# Altium schematic sheet efn32gg990.SchDoc
size C
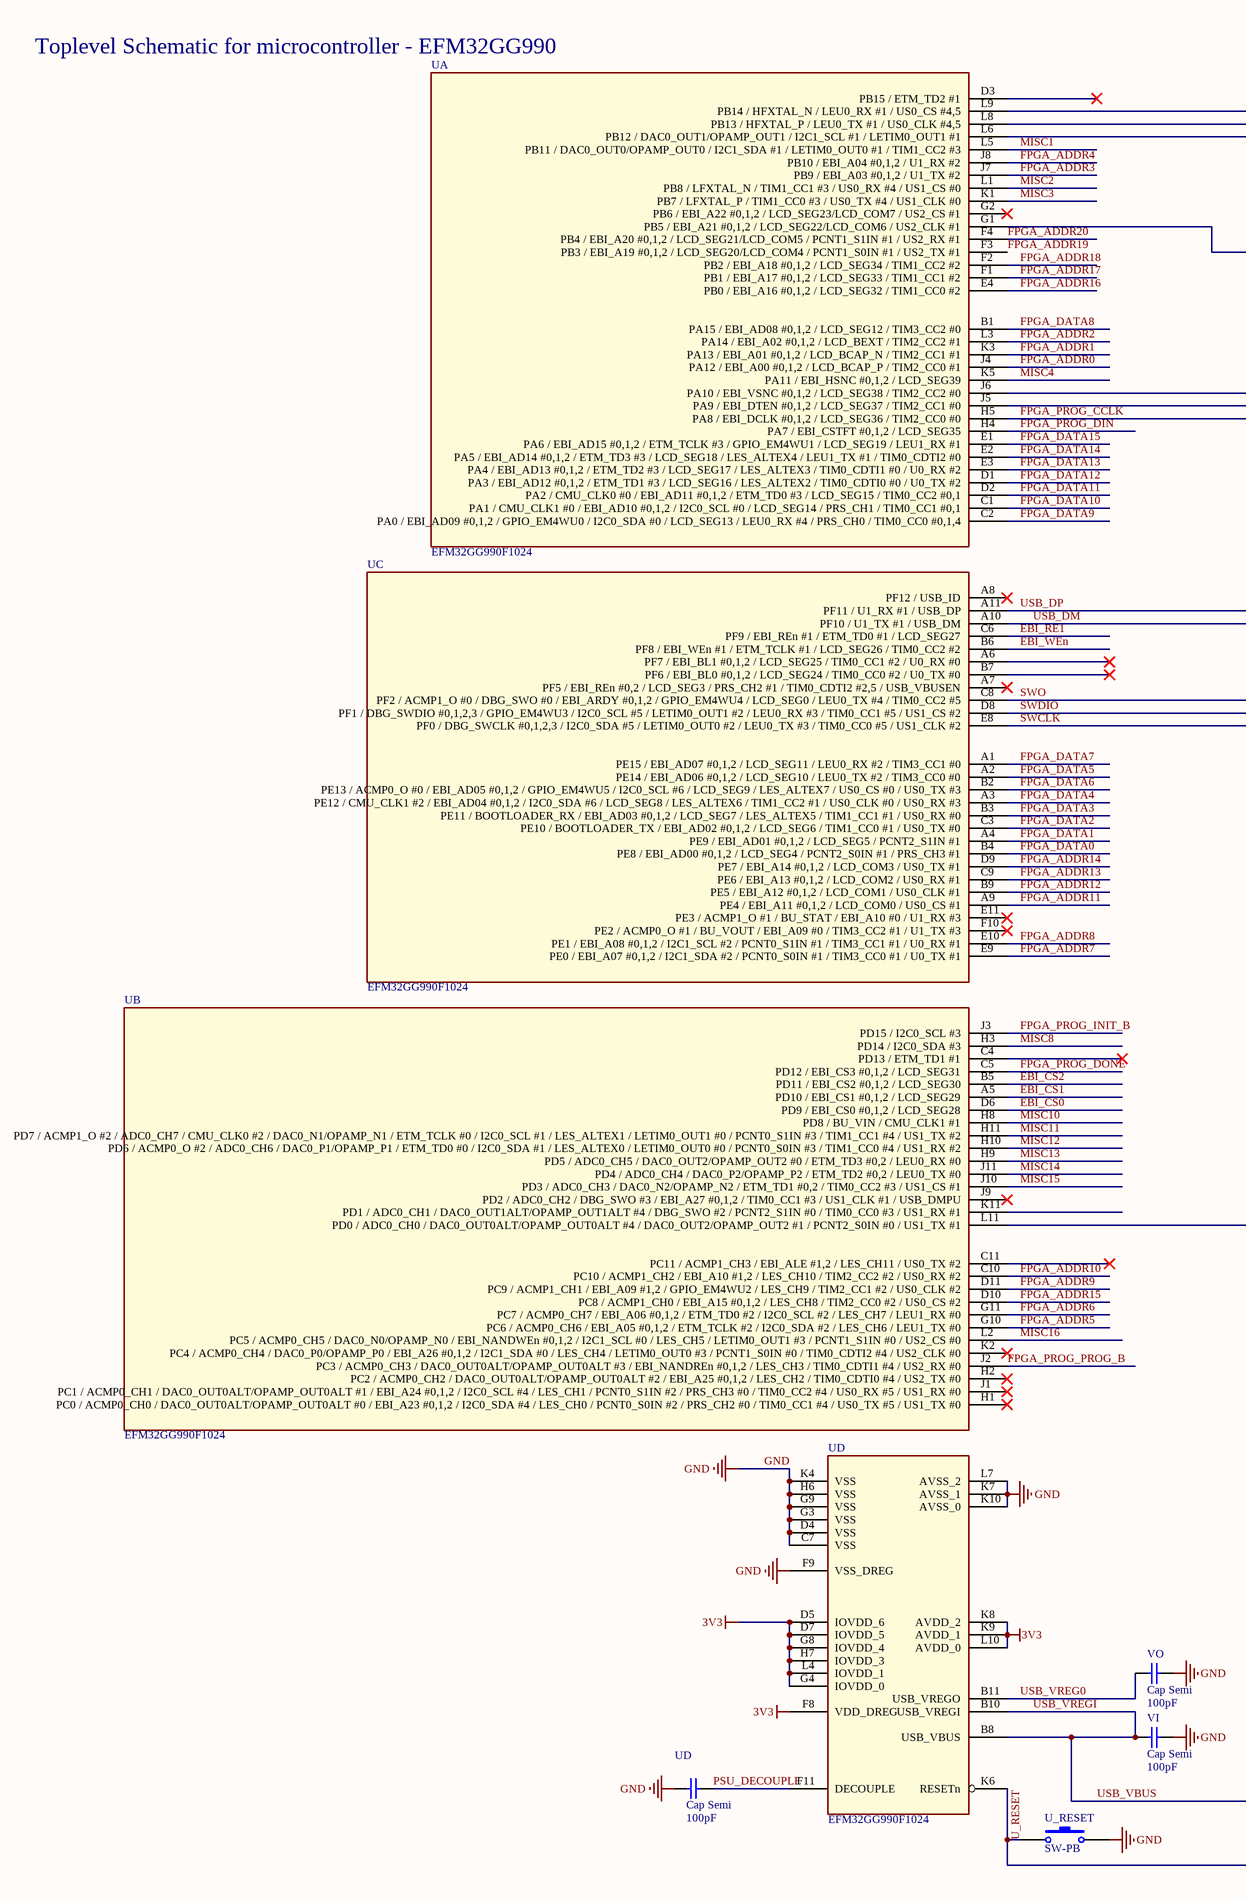
[diagram p0: efn32gg990.SchDoc, left]
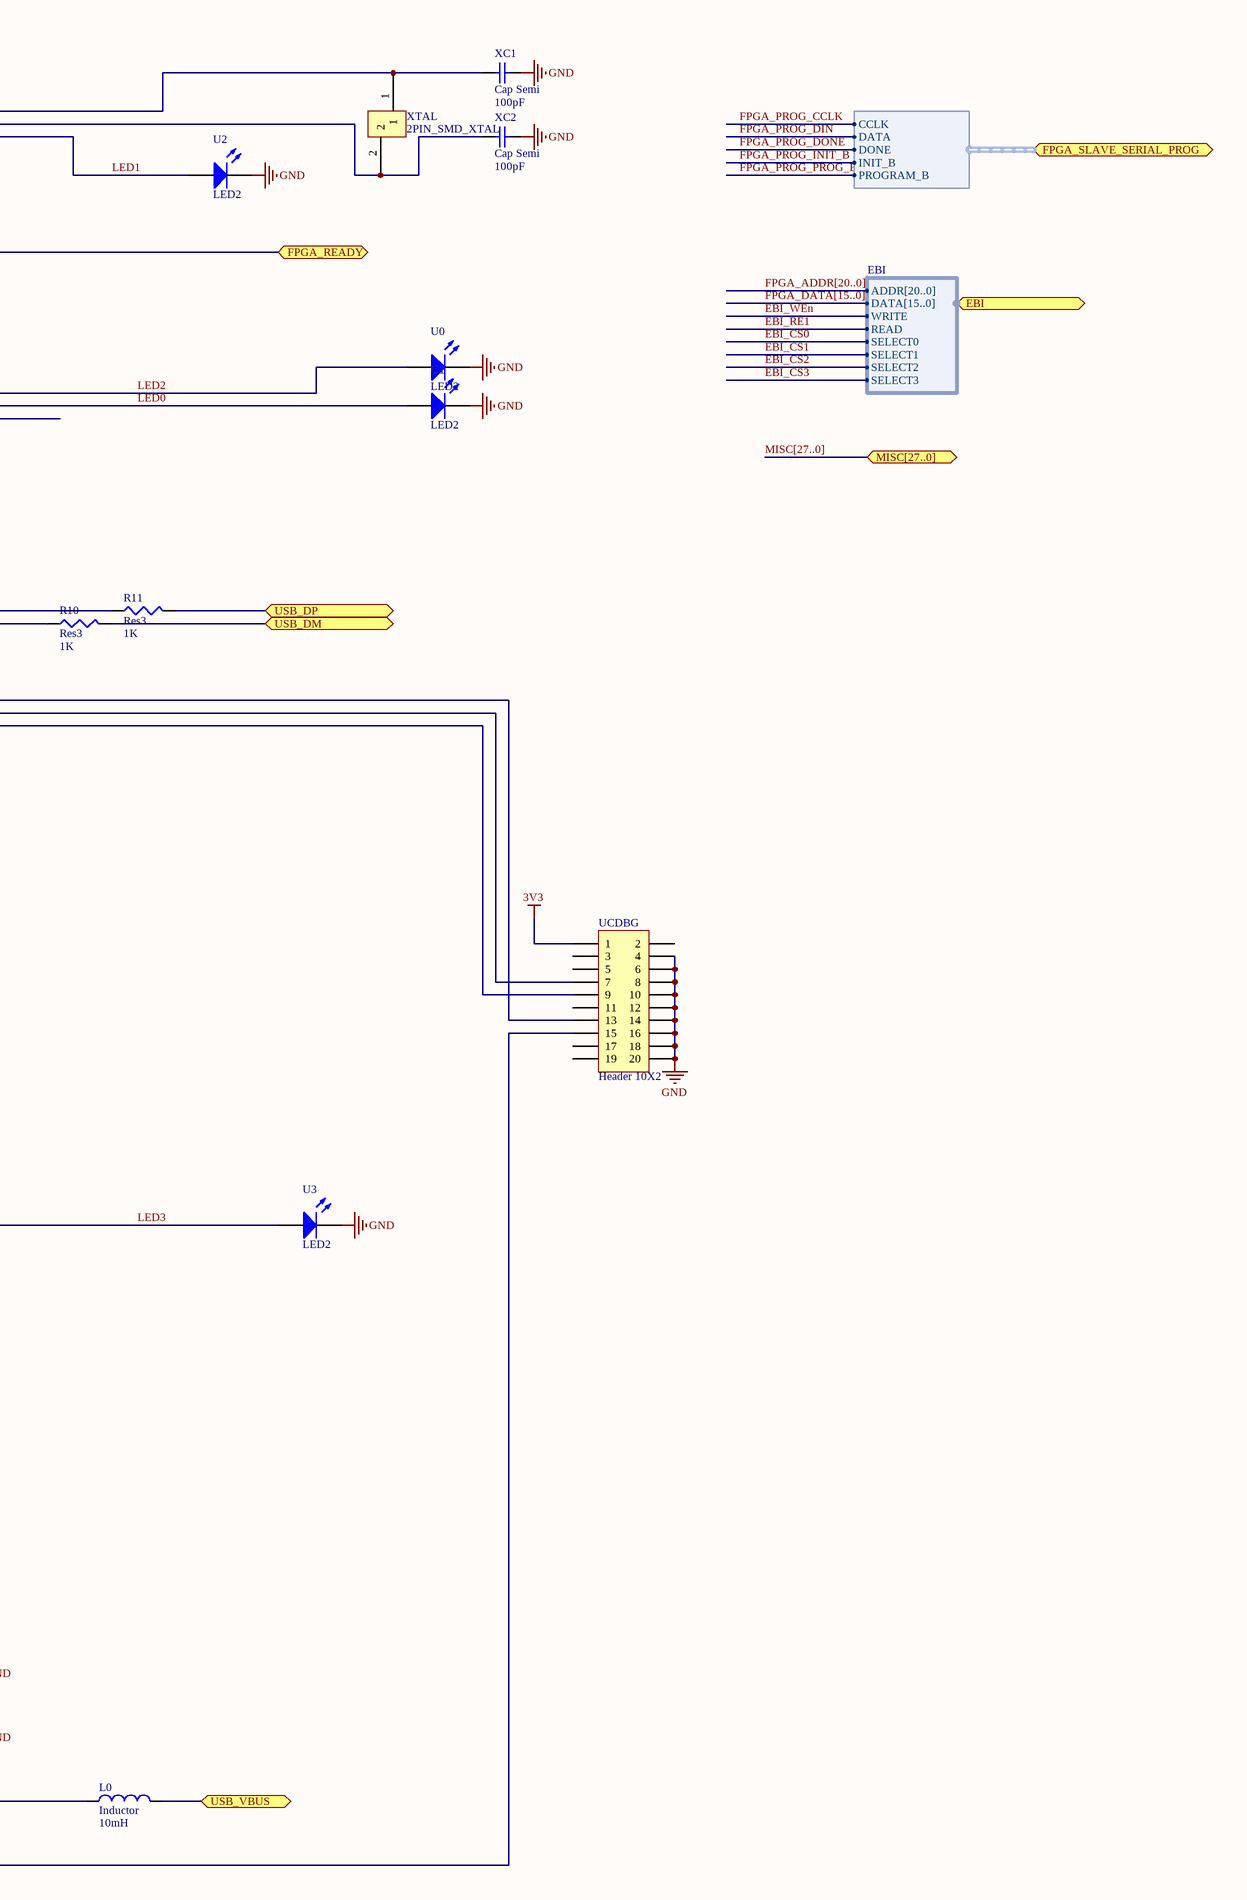
[diagram p1: efn32gg990.SchDoc, right]

## Parts
L0  Inductor  value 10mH  [C1210]
R10  Res3  value 1K  [14-1210]
R11  Res3  value 1K  [14-1210]
U  EFM32GG990F1024  [BGA112]  (parts A,B,C,D of 4)
U0  LED2  [3.2X1.6X1.1]
U1  LED2  [3.2X1.6X1.1]
U2  LED2  [3.2X1.6X1.1]
U3  LED2  [3.2X1.6X1.1]
U_RESET  SW-PB  [SPST-2]
UCDBG  Header 10X2  [HDR2X10]
UD  Cap Semi  value 100pF  [C1206]
VI  Cap Semi  value 100pF  [C1206]
VO  Cap Semi  value 100pF  [C1206]
XC1  Cap Semi  value 100pF  [C1206]
XC2  Cap Semi  value 100pF  [C1206]
XTAL  2PIN_SMD_XTAL  [48MHZ_XTAL_PAD]

## Ports
EBI (harness EBI), FPGA_READY, FPGA_SLAVE_SERIAL_PROG (harness FPGA_SLAVE_SERIAL_PROG), MISC[27..0], USB_DM, USB_DP, USB_VBUS

## Harnesses
FPGA_SLAVE_SERIAL_PROG: CCLK, DATA, DONE, INIT_B, PROGRAM_B
EBI: READ, WRITE, SELECT0, DATA[15..0], ADDR[20..0], SELECT1, SELECT2, SELECT3

## Nets
3V3: U.D5(IOVDD_6) U.D7(IOVDD_5) U.F8(VDD_DREG) U.G4(IOVDD_0) U.G8(IOVDD_4) U.H7(IOVDD_3) U.K8(AVDD_2) U.K9(AVDD_1) U.L4(IOVDD_1) U.L10(AVDD_0) UCDBG.1
GND: U.C7(VSS) U.D4(VSS) U.F9(VSS_DREG) U.G3(VSS) U.G9(VSS) U.H6(VSS) U.K4(VSS) U.K7(AVSS_1) U.K10(AVSS_0) U.L7(AVSS_2) U0.2(K) U1.2(K) U2.2(K) U3.2(K) U_RESET.2 UCDBG.4 UCDBG.6 UCDBG.8 UCDBG.10 UCDBG.12 UCDBG.14 UCDBG.16 UCDBG.18 UCDBG.20 UD.1 VI.2 VO.2 XC1.2 XC2.2
EBI_CS0: U.D6(PD9_/_EBI_CS0_#0,1,2_/_LCD_SEG28) ; port EBI.SELECT0
EBI_CS1: U.A5(PD10_/_EBI_CS1_#0,1,2_/_LCD_SEG29) ; port EBI.SELECT1
EBI_CS2: U.B5(PD11_/_EBI_CS2_#0,1,2_/_LCD_SEG30) ; port EBI.SELECT2
EBI_CS3: port EBI.SELECT3
EBI_RE1: U.C6(PF9_/_EBI_REn_#1_/_ETM_TD0_#1_/_LCD_SEG27) ; port EBI.READ
EBI_WEn: U.B6(PF8_/_EBI_WEn_#1_/_ETM_TCLK_#1_/_LCD_SEG26_/_TIM0_CC2_#2) ; port EBI.WRITE
FPGA_ADDR0: U.J4(PA12_/_EBI_A00_#0,1,2_/_LCD_BCAP_P_/_TIM2_CC0_#1)
FPGA_ADDR1: U.K3(PA13_/_EBI_A01_#0,1,2_/_LCD_BCAP_N_/_TIM2_CC1_#1)
FPGA_ADDR2: U.L3(PA14_/_EBI_A02_#0,1,2_/_LCD_BEXT_/_TIM2_CC2_#1)
FPGA_ADDR3: U.J7(PB9_/_EBI_A03_#0,1,2_/_U1_TX_#2)
FPGA_ADDR4: U.J8(PB10_/_EBI_A04_#0,1,2_/_U1_RX_#2)
FPGA_ADDR5: U.G10(PC6_/_ACMP0_CH6_/_EBI_A05_#0,1,2_/_ETM_TCLK_#2_/_I2C0_SDA_#2_/_LES_CH6_/_LEU1_TX_#0)
FPGA_ADDR6: U.G11(PC7_/_ACMP0_CH7_/_EBI_A06_#0,1,2_/_ETM_TD0_#2_/_I2C0_SCL_#2_/_LES_CH7_/_LEU1_RX_#0)
FPGA_ADDR7: U.E9(PE0_/_EBI_A07_#0,1,2_/_I2C1_SDA_#2_/_PCNT0_S0IN_#1_/_TIM3_CC0_#1_/_U0_TX_#1)
FPGA_ADDR8: U.E10(PE1_/_EBI_A08_#0,1,2_/_I2C1_SCL_#2_/_PCNT0_S1IN_#1_/_TIM3_CC1_#1_/_U0_RX_#1)
FPGA_ADDR9: U.D11(PC9_/_ACMP1_CH1_/_EBI_A09_#1,2_/_GPIO_EM4WU2_/_LES_CH9_/_TIM2_CC1_#2_/_US0_CLK_#2)
FPGA_ADDR10: U.C10(PC10_/_ACMP1_CH2_/_EBI_A10_#1,2_/_LES_CH10_/_TIM2_CC2_#2_/_US0_RX_#2)
FPGA_ADDR11: U.A9(PE4_/_EBI_A11_#0,1,2_/_LCD_COM0_/_US0_CS_#1)
FPGA_ADDR12: U.B9(PE5_/_EBI_A12_#0,1,2_/_LCD_COM1_/_US0_CLK_#1)
FPGA_ADDR13: U.C9(PE6_/_EBI_A13_#0,1,2_/_LCD_COM2_/_US0_RX_#1)
FPGA_ADDR14: U.D9(PE7_/_EBI_A14_#0,1,2_/_LCD_COM3_/_US0_TX_#1)
FPGA_ADDR15: U.D10(PC8_/_ACMP1_CH0_/_EBI_A15_#0,1,2_/_LES_CH8_/_TIM2_CC0_#2_/_US0_CS_#2)
FPGA_ADDR16: U.E4(PB0_/_EBI_A16_#0,1,2_/_LCD_SEG32_/_TIM1_CC0_#2)
FPGA_ADDR17: U.F1(PB1_/_EBI_A17_#0,1,2_/_LCD_SEG33_/_TIM1_CC1_#2)
FPGA_ADDR18: U.F2(PB2_/_EBI_A18_#0,1,2_/_LCD_SEG34_/_TIM1_CC2_#2)
FPGA_ADDR19: U.F3(PB3_/_EBI_A19_#0,1,2_/_LCD_SEG20/LCD_COM4_/_PCNT1_S0IN_#1_/_US2_TX_#1)
FPGA_ADDR20: U.F4(PB4_/_EBI_A20_#0,1,2_/_LCD_SEG21/LCD_COM5_/_PCNT1_S1IN_#1_/_US2_RX_#1)
FPGA_DATA0: U.B4(PE8_/_EBI_AD00_#0,1,2_/_LCD_SEG4_/_PCNT2_S0IN_#1_/_PRS_CH3_#1)
FPGA_DATA1: U.A4(PE9_/_EBI_AD01_#0,1,2_/_LCD_SEG5_/_PCNT2_S1IN_#1)
FPGA_DATA2: U.C3(PE10_/_BOOTLOADER_TX_/_EBI_AD02_#0,1,2_/_LCD_SEG6_/_TIM1_CC0_#1_/_US0_TX_#0)
FPGA_DATA3: U.B3(PE11_/_BOOTLOADER_RX_/_EBI_AD03_#0,1,2_/_LCD_SEG7_/_LES_ALTEX5_/_TIM1_CC1_#1_/_US0_RX_#0)
FPGA_DATA4: U.A3(PE12_/_CMU_CLK1_#2_/_EBI_AD04_#0,1,2_/_I2C0_SDA_#6_/_LCD_SEG8_/_LES_ALTEX6_/_TIM1_CC2_#1_/_US0_CLK_#0_/_US0_RX_#3)
FPGA_DATA5: U.A2(PE14_/_EBI_AD06_#0,1,2_/_LCD_SEG10_/_LEU0_TX_#2_/_TIM3_CC0_#0)
FPGA_DATA6: U.B2(PE13_/_ACMP0_O_#0_/_EBI_AD05_#0,1,2_/_GPIO_EM4WU5_/_I2C0_SCL_#6_/_LCD_SEG9_/_LES_ALTEX7_/_US0_CS_#0_/_US0_TX_#3)
FPGA_DATA7: U.A1(PE15_/_EBI_AD07_#0,1,2_/_LCD_SEG11_/_LEU0_RX_#2_/_TIM3_CC1_#0)
FPGA_DATA8: U.B1(PA15_/_EBI_AD08_#0,1,2_/_LCD_SEG12_/_TIM3_CC2_#0)
FPGA_DATA9: U.C2(PA0_/_EBI_AD09_#0,1,2_/_GPIO_EM4WU0_/_I2C0_SDA_#0_/_LCD_SEG13_/_LEU0_RX_#4_/_PRS_CH0_/_TIM0_CC0_#0,1,4)
FPGA_DATA10: U.C1(PA1_/_CMU_CLK1_#0_/_EBI_AD10_#0,1,2_/_I2C0_SCL_#0_/_LCD_SEG14_/_PRS_CH1_/_TIM0_CC1_#0,1)
FPGA_DATA11: U.D2(PA2_/_CMU_CLK0_#0_/_EBI_AD11_#0,1,2_/_ETM_TD0_#3_/_LCD_SEG15_/_TIM0_CC2_#0,1)
FPGA_DATA12: U.D1(PA3_/_EBI_AD12_#0,1,2_/_ETM_TD1_#3_/_LCD_SEG16_/_LES_ALTEX2_/_TIM0_CDTI0_#0_/_U0_TX_#2)
FPGA_DATA13: U.E3(PA4_/_EBI_AD13_#0,1,2_/_ETM_TD2_#3_/_LCD_SEG17_/_LES_ALTEX3_/_TIM0_CDTI1_#0_/_U0_RX_#2)
FPGA_DATA14: U.E2(PA5_/_EBI_AD14_#0,1,2_/_ETM_TD3_#3_/_LCD_SEG18_/_LES_ALTEX4_/_LEU1_TX_#1_/_TIM0_CDTI2_#0)
FPGA_DATA15: U.E1(PA6_/_EBI_AD15_#0,1,2_/_ETM_TCLK_#3_/_GPIO_EM4WU1_/_LCD_SEG19_/_LEU1_RX_#1)
FPGA_PROG_CCLK: U.H5(PA8_/_EBI_DCLK_#0,1,2_/_LCD_SEG36_/_TIM2_CC0_#0) ; port FPGA_SLAVE_SERIAL_PROG.CCLK
FPGA_PROG_DIN: U.H4(PA7_/_EBI_CSTFT_#0,1,2_/_LCD_SEG35) ; port FPGA_SLAVE_SERIAL_PROG.DATA
FPGA_PROG_DONE: U.C5(PD12_/_EBI_CS3_#0,1,2_/_LCD_SEG31) ; port FPGA_SLAVE_SERIAL_PROG.DONE
FPGA_PROG_INIT_B: U.J3(PD15_/_I2C0_SCL_#3) ; port FPGA_SLAVE_SERIAL_PROG.INIT_B
FPGA_PROG_PROG_B: U.J2(PC3_/_ACMP0_CH3_/_DAC0_OUT0ALT/OPAMP_OUT0ALT_#3_/_EBI_NANDREn_#0,1,2_/_LES_CH3_/_TIM0_CDTI1_#4_/_US2_RX_#0) ; port FPGA_SLAVE_SERIAL_PROG.PROGRAM_B
FPGA_READY: U.G1(PB5_/_EBI_A21_#0,1,2_/_LCD_SEG22/LCD_COM6_/_US2_CLK_#1) ; port FPGA_READY
LED0: U.J5(PA9_/_EBI_DTEN_#0,1,2_/_LCD_SEG37_/_TIM2_CC1_#0) U1.1(A)
LED1: U.L6(PB12_/_DAC0_OUT1/OPAMP_OUT1_/_I2C1_SCL_#1_/_LETIM0_OUT1_#1) U2.1(A)
LED2: U.J6(PA10_/_EBI_VSNC_#0,1,2_/_LCD_SEG38_/_TIM2_CC2_#0) U0.1(A)
LED3: U.L11(PD0_/_ADC0_CH0_/_DAC0_OUT0ALT/OPAMP_OUT0ALT_#4_/_DAC0_OUT2/OPAMP_OUT2_#1_/_PCNT2_S0IN_#0_/_US1_TX_#1) U3.1(A)
MISC1: U.L5(PB11_/_DAC0_OUT0/OPAMP_OUT0_/_I2C1_SDA_#1_/_LETIM0_OUT0_#1_/_TIM1_CC2_#3)
MISC2: U.L1(PB8_/_LFXTAL_N_/_TIM1_CC1_#3_/_US0_RX_#4_/_US1_CS_#0)
MISC3: U.K1(PB7_/_LFXTAL_P_/_TIM1_CC0_#3_/_US0_TX_#4_/_US1_CLK_#0)
MISC4: U.K5(PA11_/_EBI_HSNC_#0,1,2_/_LCD_SEG39)
MISC8: U.H3(PD14_/_I2C0_SDA_#3)
MISC10: U.H8(PD8_/_BU_VIN_/_CMU_CLK1_#1)
MISC11: U.H11(PD7_/_ACMP1_O_#2_/_ADC0_CH7_/_CMU_CLK0_#2_/_DAC0_N1/OPAMP_N1_/_ETM_TCLK_#0_/_I2C0_SCL_#1_/_LES_ALTEX1_/_LETIM0_OUT1_#0_/_PCNT0_S1IN_#3_/_TIM1_CC1_#4_/_US1_TX_#2)
MISC12: U.H10(PD6_/_ACMP0_O_#2_/_ADC0_CH6_/_DAC0_P1/OPAMP_P1_/_ETM_TD0_#0_/_I2C0_SDA_#1_/_LES_ALTEX0_/_LETIM0_OUT0_#0_/_PCNT0_S0IN_#3_/_TIM1_CC0_#4_/_US1_RX_#2)
MISC13: U.H9(PD5_/_ADC0_CH5_/_DAC0_OUT2/OPAMP_OUT2_#0_/_ETM_TD3_#0,2_/_LEU0_RX_#0)
MISC14: U.J11(PD4_/_ADC0_CH4_/_DAC0_P2/OPAMP_P2_/_ETM_TD2_#0,2_/_LEU0_TX_#0)
MISC15: U.J10(PD3_/_ADC0_CH3_/_DAC0_N2/OPAMP_N2_/_ETM_TD1_#0,2_/_TIM0_CC2_#3_/_US1_CS_#1)
MISC16: U.L2(PC5_/_ACMP0_CH5_/_DAC0_N0/OPAMP_N0_/_EBI_NANDWEn_#0,1,2_/_I2C1_SCL_#0_/_LES_CH5_/_LETIM0_OUT1_#3_/_PCNT1_S1IN_#0_/_US2_CS_#0)
PSU_DECOUPLE: U.F11(DECOUPLE) UD.2
SWCLK: U.E8(PF0_/_DBG_SWCLK_#0,1,2,3_/_I2C0_SDA_#5_/_LETIM0_OUT0_#2_/_LEU0_TX_#3_/_TIM0_CC0_#5_/_US1_CLK_#2) UCDBG.9
SWDIO: U.D8(PF1_/_DBG_SWDIO_#0,1,2,3_/_GPIO_EM4WU3_/_I2C0_SCL_#5_/_LETIM0_OUT1_#2_/_LEU0_RX_#3_/_TIM0_CC1_#5_/_US1_CS_#2) UCDBG.7
SWO: U.C8(PF2_/_ACMP1_O_#0_/_DBG_SWO_#0_/_EBI_ARDY_#0,1,2_/_GPIO_EM4WU4_/_LCD_SEG0_/_LEU0_TX_#4_/_TIM0_CC2_#5) UCDBG.13
U_RESET: U.K6(RESETn) U_RESET.1 UCDBG.15
USB_DM: R10.1 U.A10(PF10_/_U1_TX_#1_/_USB_DM)
USB_DM: R10.2 ; port USB_DM  [a separate net that carries the same name]
USB_DP: R11.1 U.A11(PF11_/_U1_RX_#1_/_USB_DP)
USB_DP: R11.2 ; port USB_DP  [a separate net that carries the same name]
USB_VBUS: L0.1 U.B8(USB_VBUS) U.B10(USB_VREGI) VI.1  [also labelled USB_VREGI]
USB_VBUS: L0.2 ; port USB_VBUS  [a separate net that carries the same name]
USB_VREG0: U.B11(USB_VREGO) VO.1
NetU_L8: U.L8(PB13_/_HFXTAL_P_/_LEU0_TX_#1_/_US0_CLK_#4,5) XC2.1 XTAL.2
NetU_L9: U.L9(PB14_/_HFXTAL_N_/_LEU0_RX_#1_/_US0_CS_#4,5) XC1.1 XTAL.1

Not connected (* = marked no-connect by the designer): U A6(PF7_/_EBI_BL1_#0,1,2_/_LCD_SEG25_/_TIM0_CC1_#2_/_U0_RX_#0)* A7(PF5_/_EBI_REn_#0,2_/_LCD_SEG3_/_PRS_CH2_#1_/_TIM0_CDTI2_#2,5_/_USB_VBUSEN)* A8(PF12_/_USB_ID)* B7(PF6_/_EBI_BL0_#0,1,2_/_LCD_SEG24_/_TIM0_CC0_#2_/_U0_TX_#0)* C4(PD13_/_ETM_TD1_#1)* C11(PC11_/_ACMP1_CH3_/_EBI_ALE_#1,2_/_LES_CH11_/_US0_TX_#2)* D3(PB15_/_ETM_TD2_#1)* E11(PE3_/_ACMP1_O_#1_/_BU_STAT_/_EBI_A10_#0_/_U1_RX_#3)* F10(PE2_/_ACMP0_O_#1_/_BU_VOUT_/_EBI_A09_#0_/_TIM3_CC2_#1_/_U1_TX_#3)* G2(PB6_/_EBI_A22_#0,1,2_/_LCD_SEG23/LCD_COM7_/_US2_CS_#1)* H1(PC0_/_ACMP0_CH0_/_DAC0_OUT0ALT/OPAMP_OUT0ALT_#0_/_EBI_A23_#0,1,2_/_I2C0_SDA_#4_/_LES_CH0_/_PCNT0_S0IN_#2_/_PRS_CH2_#0_/_TIM0_CC1_#4_/_US0_TX_#5_/_US1_TX_#0)* H2(PC2_/_ACMP0_CH2_/_DAC0_OUT0ALT/OPAMP_OUT0ALT_#2_/_EBI_A25_#0,1,2_/_LES_CH2_/_TIM0_CDTI0_#4_/_US2_TX_#0)* J1(PC1_/_ACMP0_CH1_/_DAC0_OUT0ALT/OPAMP_OUT0ALT_#1_/_EBI_A24_#0,1,2_/_I2C0_SCL_#4_/_LES_CH1_/_PCNT0_S1IN_#2_/_PRS_CH3_#0_/_TIM0_CC2_#4_/_US0_RX_#5_/_US1_RX_#0)* J9(PD2_/_ADC0_CH2_/_DBG_SWO_#3_/_EBI_A27_#0,1,2_/_TIM0_CC1_#3_/_US1_CLK_#1_/_USB_DMPU)* K2(PC4_/_ACMP0_CH4_/_DAC0_P0/OPAMP_P0_/_EBI_A26_#0,1,2_/_I2C1_SDA_#0_/_LES_CH4_/_LETIM0_OUT0_#3_/_PCNT1_S0IN_#0_/_TIM0_CDTI2_#4_/_US2_CLK_#0)* K11(PD1_/_ADC0_CH1_/_DAC0_OUT1ALT/OPAMP_OUT1ALT_#4_/_DBG_SWO_#2_/_PCNT2_S1IN_#0_/_TIM0_CC0_#3_/_US1_RX_#1); UCDBG 2 3 5 11 17 19

## Buses and harness runs
bus FPGA_ADDR[20..0]
bus FPGA_DATA[15..0]
bus MISC[27..0] = port MISC[27..0]

## Notes on the sheet
- Toplevel Schematic for microcontroller - EFM32GG990

## Library data of the parts
L0 = Inductor: Code_IEC: 1005; Published: 8-Jun-2000; LatestRevisionDate: 29-May-2009; LatestRevisionNote: IPC-7351 Footprint Added.; PackageReference: 0402-A; Publisher: Altium Limited; PackageDescription: Chip Inductor; Code_JEITA: 0402
R10 R11 = Res3: Resistor; Published: 8-Jun-2000; LatestRevisionDate: 29-May-2009; LatestRevisionNote: IPC-7351 Footprint Added.; PackageReference: J1-0603; Publisher: Altium Limited; PackageDescription: Chip Resistor
U0-U3 = LED2: Typical RED, GREEN, YELLOW, AMBER GaAs LED; Published: 8-Jun-2000; LatestRevisionDate: 17-Jul-2002; LatestRevisionNote: Re-released for DXP Platform.; PackageVersion: Feb-2002; PackageReference: 3.2X1.6X1.1; Publisher: Altium Limited; PackageDescription: SM LED; 2 Flat Leads
U_RESET = SW-PB: Switch; Published: 24-Mar-1999; LatestRevisionDate: 17-Jul-2002; LatestRevisionNote: Re-released for DXP Platform.; PackageReference: SPST-2; Publisher: Altium Limited; PackageDescription: Switch; 2 Leads
UCDBG = Header 10X2: Header, 10-Pin, Dual row; LatestRevisionDate: 17-Jul-2002; LatestRevisionNote: Re-released for DXP Platform.; Publisher: Altium Limited
UD VI VO XC1 XC2 = Cap Semi: Capacitor (Semiconductor SIM Model); Published: 8-Jun-2000; LatestRevisionDate: 29-May-2009; LatestRevisionNote: IPC-7351 Footprint Added.; PackageReference: C1206; Publisher: Altium Limited; PackageDescription: Chip Capacitor